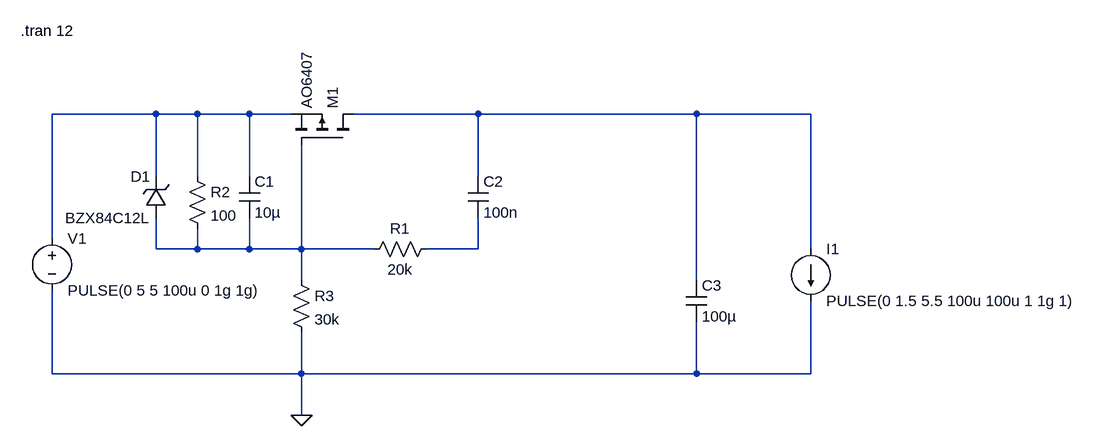
[diagram p0: schematic Draft1.asc]
Draft1.asc, the LTspice schematic file:
Version 4.1
SHEET 1 1492 680
WIRE 48 -128 -112 -128
WIRE 112 -128 48 -128
WIRE 192 -128 112 -128
WIRE 256 -128 192 -128
WIRE 544 -128 352 -128
WIRE 880 -128 544 -128
WIRE 1056 -128 880 -128
WIRE 48 -32 48 -128
WIRE 112 -32 112 -128
WIRE 192 -32 192 -128
WIRE 544 -32 544 -128
WIRE -112 64 -112 -128
WIRE 48 80 48 32
WIRE 112 80 112 48
WIRE 112 80 48 80
WIRE 192 80 192 32
WIRE 192 80 112 80
WIRE 272 80 272 -80
WIRE 272 80 192 80
WIRE 384 80 272 80
WIRE 544 80 544 32
WIRE 544 80 464 80
WIRE 1056 80 1056 -128
WIRE 272 128 272 80
WIRE 880 128 880 -128
WIRE -112 272 -112 144
WIRE 272 272 272 208
WIRE 272 272 -112 272
WIRE 880 272 880 192
WIRE 880 272 272 272
WIRE 1056 272 1056 160
WIRE 1056 272 880 272
WIRE 272 336 272 272
FLAG 272 336 0
SYMBOL voltage -112 48 R0
WINDOW 123 0 0 Left 0
WINDOW 39 0 0 Left 0
SYMATTR InstName V1
SYMATTR Value PULSE(0 5 5 100u 0 1g 1g)
SYMBOL cap 176 -32 R0
SYMATTR InstName C1
SYMATTR Value 10µ
SYMBOL res 480 64 R90
WINDOW 0 0 56 VBottom 2
WINDOW 3 32 56 VTop 2
SYMATTR InstName R1
SYMATTR Value 20k
SYMBOL pmos 352 -80 M270
SYMATTR InstName M1
SYMATTR Value AO6407
SYMBOL res 96 -48 R0
SYMATTR InstName R2
SYMATTR Value 100
SYMBOL cap 528 -32 R0
SYMATTR InstName C2
SYMATTR Value 100n
SYMBOL zener 64 32 R180
WINDOW 0 24 64 Left 2
WINDOW 3 24 0 Left 2
SYMATTR InstName D1
SYMATTR Value BZX84C12L
SYMBOL res 256 112 R0
SYMATTR InstName R3
SYMATTR Value 30k
SYMBOL cap 864 128 R0
SYMATTR InstName C3
SYMATTR Value 100µ
SYMBOL current 1056 80 R0
WINDOW 123 0 0 Left 0
WINDOW 39 0 0 Left 0
SYMATTR InstName I1
SYMATTR Value PULSE(0 1.5 5.5 100u 100u 1 1g 1)
TEXT -160 -256 Left 2 !.tran 12

The netlist it stands for:
* Draft1.asc
V1 N001 0 PULSE(0 5 5 100u 0 1g 1g)
C1 N001 N003 10µ
R1 N004 N003 20k
M1 N002 N003 N001 N001 AO6407
R2 N001 N003 100
C2 N002 N004 100n
D1 N003 N001 BZX84C12L
R3 N003 0 30k
C3 N002 0 100µ
I1 N002 0 PULSE(0 1.5 5.5 100u 100u 1 1g 1)
.model D D
.lib standard.dio
.model NMOS NMOS
.model PMOS PMOS
.lib standard.mos
.tran 12
.backanno
.end